# EAGLE design tick-mini-mk-3.0 (EAGLE 6.5.0)
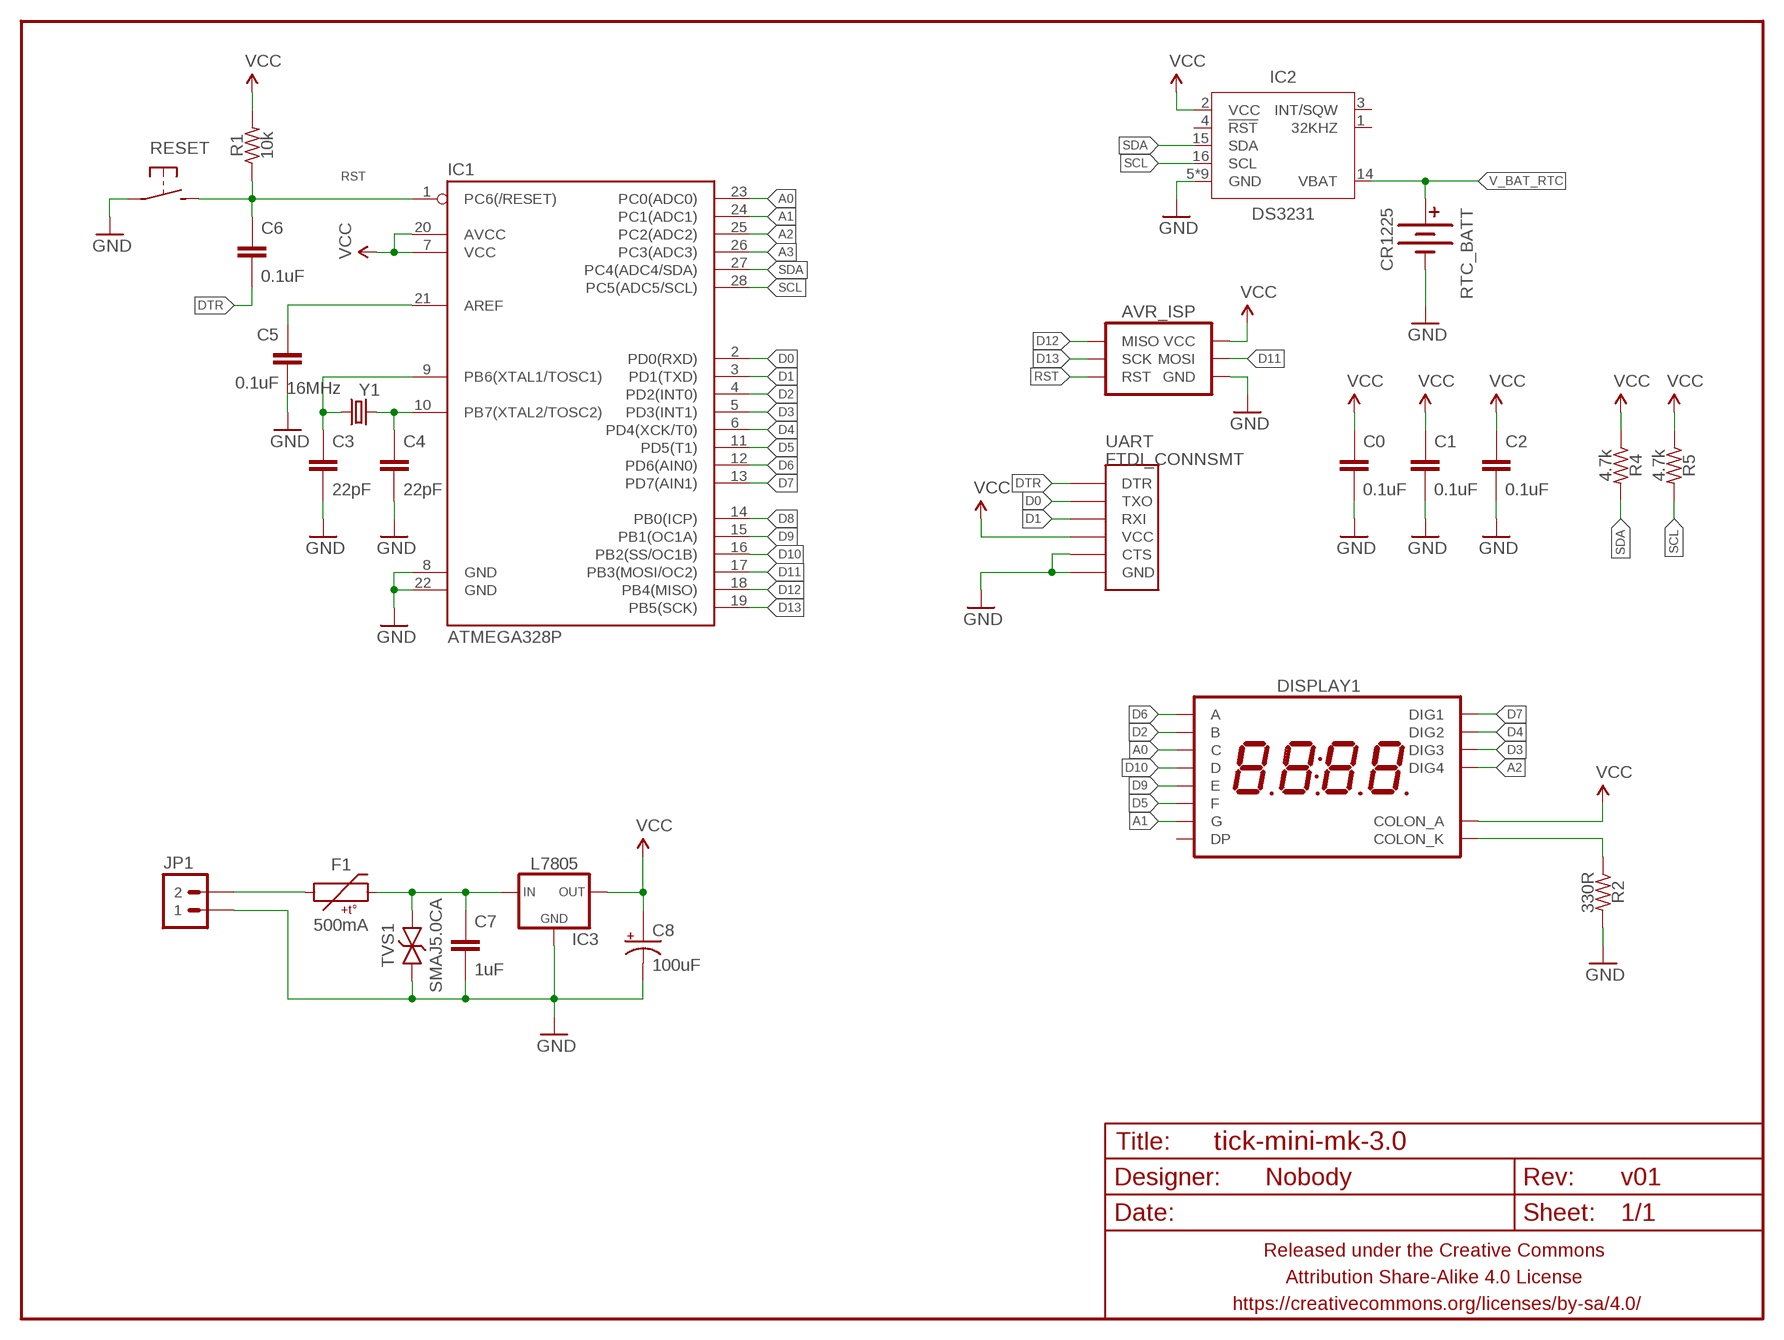
[diagram p0: schematic, sheet 1]

## Parts
AVR_ISP  AVR_SPI_PRG_6PTH  [2X3]
C0  0.1uF  CAPACITOR-CERAMICC0603  [C0603]
C1  0.1uF  CAPACITOR-CERAMICC0603  [C0603]
C2  0.1uF  CAPACITOR-CERAMICC0603  [C0603]
C3  22pF  CAPACITOR-CERAMICC0603  [C0603]
C4  22pF  CAPACITOR-CERAMICC0603  [C0603]
C5  0.1uF  CAPACITOR-CERAMICC0603  [C0603]
C6  0.1uF  CAPACITOR-CERAMICC0603  [C0603]
C7  1uF  CAPACITOR-CERAMICC0805  [C0805]
C8  100uF  CAPACITOR-POLARIZEDE2.5-5  [E2,5-5]
DISPLAY1  7SEG_4DIGIT_COLON14.2MM-CC-NS  [7SEG_4DIG_NS]
F1  500mA  PTCSMD  [PTC-1206]
FRAME1  FRAME-LETTERNO_PACKAGE  [DUMMY]
IC1  ATMEGA328P  ATMEGA328P_PDIP  [DIL28-3]
IC2  DS3231  [SO16W]
IC3  L7805  V_REG_78XX  [SO08]
JP1  M02PTH-CENTERED-R+  [1X02-CENTER-R+]
R1  10k  RESISTORR0603  [R0603]
R2  330R  RESISTORPTH-AXIAL-7.62MM  [RESISTOR-AXIAL-PTH-7.62MM]
R4  4.7k  RESISTORR0603  [R0603]
R5  4.7k  RESISTORR0603  [R0603]
RESET  SPST-NO-TACT3MM-PTH-SMALL-PADS  [DTS-3-SMALL-PADS]
RTC_BATT  CR1225  BATTERY12MM  [BATTCON_12MM]
TVS1  SMAJ5.0CA  TVSSMA  [SMA-DIODE-TVS-BIDIR]
UART  FTDI_CONNSMT  [FTDI_CONN_SMT]
Y1  16MHz  CRYSTALHC49UV  [HC49U-V]

## Nets
A0: DISPLAY1.P$4(C) IC1.23(PC0(ADC0))
A1: DISPLAY1.P$5(G) IC1.24(PC1(ADC1))
A2: DISPLAY1.P$6(DIG4) IC1.25(PC2(ADC2))
A3: IC1.26(PC3(ADC3))
D0: IC1.2(PD0(RXD)) UART.TXO
D1: IC1.3(PD1(TXD)) UART.RXI
D2: DISPLAY1.P$9(B) IC1.4(PD2(INT0))
D3: DISPLAY1.P$10(DIG3) IC1.5(PD3(INT1))
D4: DISPLAY1.P$11(DIG2) IC1.6(PD4(XCK/T0))
D5: DISPLAY1.P$12(F) IC1.11(PD5(T1))
D6: DISPLAY1.P$13(A) IC1.12(PD6(AIN0))
D7: DISPLAY1.P$14(DIG1) IC1.13(PD7(AIN1))
D8: IC1.14(PB0(ICP))
D9: DISPLAY1.P$1(E) IC1.15(PB1(OC1A))
D10: DISPLAY1.P$2(D) IC1.16(PB2(SS/OC1B))
D11: AVR_ISP.4(MOSI) IC1.17(PB3(MOSI/OC2))
D12: AVR_ISP.1(MISO) IC1.18(PB4(MISO))
D13: AVR_ISP.3(SCK) IC1.19(PB5(SCK))
DTR: C6.2 UART.DTR
GND: AVR_ISP.6(GND) C0.2 C1.2 C2.2 C3.2 C4.2 C5.2 C7.2 C8.- IC1.8(GND) IC1.22(GND) IC2.5(GND) IC2.6(GND) IC2.7(GND) IC2.8(GND) IC2.9(GND) IC2.10(GND) IC2.11(GND) IC2.12(GND) IC2.13(GND) IC3.2(GND) IC3.3(GND) IC3.4(GND) IC3.5(GND) IC3.6(GND) IC3.7(GND) JP1.1 R2.P$2 RESET.1 RTC_BATT.GND(-) TVS1.1 UART.CTS UART.GND
N$1: C4.1 IC1.10(PB7(XTAL2/TOSC2)) Y1.1
N$2: C3.1 IC1.9(PB6(XTAL1/TOSC1)) Y1.2
N$3: C5.1 IC1.21(AREF)
N$4: DISPLAY1.P$7(COLON_K) R2.P$1
N$5: F1.1 JP1.2
N$8: C7.1 F1.2 IC3.8(IN) TVS1.2
RST: AVR_ISP.5(RST) C6.1 IC1.1(PC6(/RESET)) R1.1 RESET.2
SCL: IC1.28(PC5(ADC5/SCL)) IC2.16(SCL) R5.2
SDA: IC1.27(PC4(ADC4/SDA)) IC2.15(SDA) R4.2
V_BAT_RTC: IC2.14(VBAT) RTC_BATT.PWR@1(+)
VCC: AVR_ISP.2(VCC) C0.1 C1.1 C2.1 C8.+ DISPLAY1.P$8(COLON_A) IC1.7(VCC) IC1.20(AVCC) IC2.2(VCC) IC3.1(OUT) R1.2 R4.1 R5.1 UART.VCC
Unconnected: DISPLAY1.P$3(DP) IC2.1(32KHZ) IC2.3(INT/SQW) IC2.4(!RST)

## Library data of the parts
AVR_ISP = A_butts:AVR_SPI_PRG_6: AVR ISP 6 Pin This is the reduced ISP connector for AVR programming. Common on Arduino. This footprint will take up less PCB space and can be used with a 10-pin to 6-pin adapter such as SKU: BOB-08508 **Special note about "TEST_POINT" package. The stop mask is on the top side, so if you want your programming test points to be on the bottom of your board, make sure to place this package on the bottom side of the board. This also ensure that the orientation to program from the bottom side will be correct.
C0 C1-C7 = A_butts:CAPACITOR-CERAMIC: CAPACITOR, European symbol
C8 = A_butts:CAPACITOR-POLARIZED: POLARIZED CAPACITOR, American symbol
DISPLAY1 = A_butts:7SEG_4DIGIT_COLON
F1 = A_butts:PTC: Resettable Fuse PTC Resettable Fuse. Spark Fun Electronics SKU : COM-08357; PROD_ID: RES-11150
FRAME1 = A_butts:FRAME-LETTER: Schematic Frame Standard 8.5x11 US Letter frame; DESIGNER: Nobody; VERSION: v01
IC1 = A_butts:ATMEGA328P_PDIP: uC used in the Arduino 32kb flash, 1k EEPROM, 2k SRAM This is the through-hole version of this chip.
IC2 = A_butts:DS3231
IC3 = A_butts:V_REG_78XX: Voltage Regulator Standard 7805 5V regulator. IGO (Input Ground Output). Spark Fun Electronics SKU : COM-00107
JP1 = A_butts:M02: Standard 2-pin 0.1" header. Use with - straight break away headers ( PRT-00116) - right angle break away headers (PRT-00553) - swiss pins (PRT-00743) - machine pins (PRT-00117) - female headers (PRT-00115) Molex polarized connector foot print use with: PRT-08233 with associated crimp pins and housings. 2.54_SCREWTERM for use with PRT-10571. 3.5mm Screw Terminal footprints for PRT-08084 5mm Screw Terminal footprints for use with PRT-08433
R1 R2 R4 R5 = A_butts:RESISTOR: RESISTOR, American symbol
RESET = A_butts:SPST-NO-TACT
RTC_BATT = A_butts:BATTERY: Battery Holders Various common sizes : AA, AAA, 20mm coin cell and 12mm coin cell. 20MM_4LEGS, BATT-10373
TVS1 = A_butts:TVS: Transient voltage suppressor- prevents ESD on inputs. Ignore package description- MBRA140 is NOT this type of part!!!
UART = A_butts:FTDI_CONN: Connector which mates to FTDI basic or FTDI cable.
Y1 = A_butts:CRYSTAL: Various standard crystals. Proven footprints. Spark Fun Electronics SKU : COM-00534

## Board
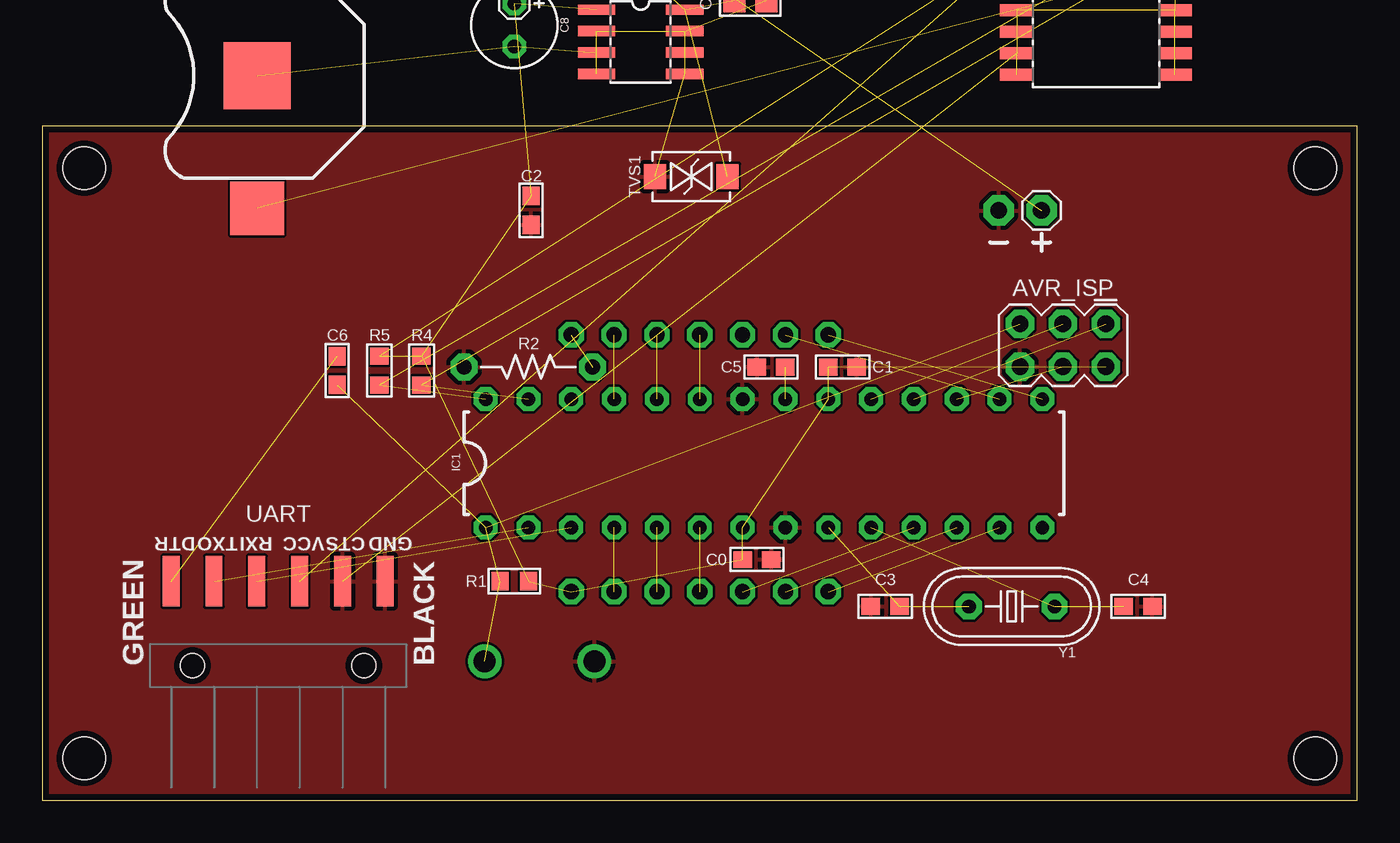
[diagram p1: board, top side]
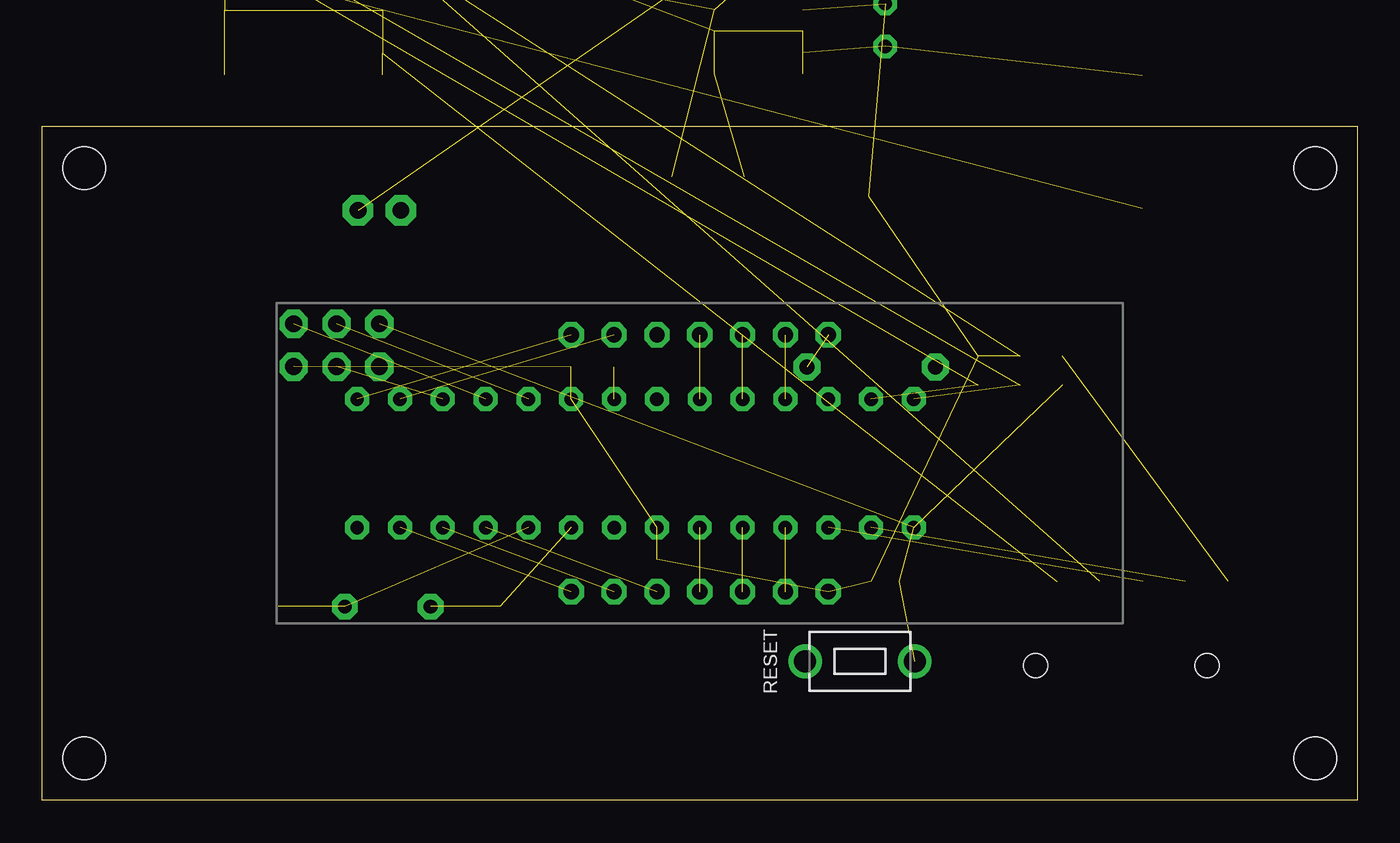
[diagram p2: board, bottom side, seen from below]

Size 78 x 40 mm. Coordinates in mm from the lower left corner, seen from the top.
Outline: 78,0 78,40 0,40 0,0 78,0
Copper layers (1*16): Top 0.0356mm / dielectric 1.5011mm / Bottom 0.0356mm
Design rules "LaenPCBOrder_2": minimum track width 6mil, minimum drill 13mil, track to track 6mil, track to pad 6mil, pad to pad 6mil, via to via 6mil, smd to smd 6mil, copper to edge 15mil, drill to drill 6mil, minimum pad ring 7mil, minimum via ring 7mil, stop-mask expansion 3mil, vias tented up to drill 20mil, thermal gap 10mil
Holes 2.5 mm at 2.5,37.5 2.5,2.5 75.5,2.5 75.5,37.5

### Footprints (pad centres in the part's own frame; a part is rotated, then mirrored left to right if it is on the bottom)
2X3 = drill 1 pad 1.676 octagon: 1 -2.54,-1.27; 2 -2.54,1.27; 3 0,-1.27; 4 0,1.27; 5 2.54,-1.27; 6 2.54,1.27
C0603 = smd 1.1 x 1: 1 -0.85,0; 2 0.85,0
C0805 = smd 1.3 x 1.5: 1 -0.95,0; 2 0.95,0
E2,5-5 = drill 0.8 pad 1.4 octagon: + -1.27,0; - 1.27,0
7SEG_4DIG_NS = drill 0.9 pad 1.5 octagon: P$1 -7.62,7.62; P$2 -5.08,7.62; P$3 -2.54,7.62; P$4 0,7.62; P$5 2.54,7.62; P$6 5.08,7.62; P$7 7.62,7.62; P$8 7.62,-7.62; P$9 5.08,-7.62; P$10 2.54,-7.62; P$11 0,-7.62; P$12 -2.54,-7.62; P$13 -5.08,-7.62; P$14 -7.62,-7.62
PTC-1206 = smd 1 x 1.8: 1 -1.4,0; 2 1.4,0
DIL28-3 = drill 0.8 pad 1.422 octagon: 1 -16.51,-3.81; 2 -13.97,-3.81; 3 -11.43,-3.81; 4 -8.89,-3.81; 5 -6.35,-3.81; 6 -3.81,-3.81; 7 -1.27,-3.81; 8 1.27,-3.81; 9 3.81,-3.81; 10 6.35,-3.81; 11 8.89,-3.81; 12 11.43,-3.81; 13 13.97,-3.81; 14 16.51,-3.81; 15 16.51,3.81; 16 13.97,3.81; 17 11.43,3.81; 18 8.89,3.81; 19 6.35,3.81; 20 3.81,3.81; 21 1.27,3.81; 22 -1.27,3.81; 23 -3.81,3.81; 24 -6.35,3.81; 25 -8.89,3.81; 26 -11.43,3.81; 27 -13.97,3.81; 28 -16.51,3.81
SO16W = smd 0.7 x 2: 1 -4.445,-4.685; 2 -3.175,-4.685; 3 -1.905,-4.685; 4 -0.635,-4.685; 5 0.635,-4.685; 6 1.905,-4.685; 7 3.175,-4.685; 8 4.445,-4.685; 9 4.445,4.685; 10 3.175,4.685; 11 1.905,4.685; 12 0.635,4.685; 13 -0.635,4.685; 14 -1.905,4.685; 15 -3.175,4.685; 16 -4.445,4.685
SO08 = smd 0.61 x 2.21: 1 -1.905,-2.616; 2 -0.635,-2.616; 3 0.635,-2.616; 4 1.905,-2.616; 5 1.905,2.616; 6 0.635,2.616; 7 -0.635,2.616; 8 -1.905,2.616
1X02-CENTER-R+ = drill 1 pad 1.8 octagon: 1 -1.27,0; 2 1.27,0
R0603 = smd 1 x 1.1: 1 -0.85,0; 2 0.85,0
RESISTOR-AXIAL-PTH-7.62MM = drill 0.9 pad 1.6 octagon: P$1 -3.81,0; P$2 3.81,0
DTS-3-SMALL-PADS = drill 1.3 pad 2: 1 -3.25,0; 2 3.25,0
BATTCON_12MM = smd 3.962 x 3.962: GND 0,0 | smd 3.175 x 3.175: PWR@1 -7.874,0; PWR@2 7.874,0
SMA-DIODE-TVS-BIDIR = smd 1.3 x 1.5: 1 -2.15,0; 2 2.15,0
FTDI_CONN_SMT = smd 1 x 3: CTS 3.81,0; DTR -6.35,0; GND 6.35,0; RXI -1.27,0; TXO -3.81,0; VCC 1.27,0 | hole 1.4: -5.08,-5; 5.08,-5
HC49U-V = drill 0.813 pad 1.524 octagon: 1 -2.54,0; 2 2.54,0

### Placement (x,y rotation side)
AVR_ISP  60.54,27 180 top
C0  42.39,14.29 0 top
C1  47.47,25.71 0 top
C2  29,35 270 top
C3  50,11.5 180 top
C4  65,11.5 0 top
C5  43.23,25.71 180 top
C6  17.5,25.5 90 top
C7  42,47.5 0 top  (outside the outline)
C8  28,46 270 top  (outside the outline)
DISPLAY1  39,20 0 bottom
F1  35.5,50.5 180 top  (outside the outline)
FRAME1  0,0 0 top
IC1  42.81,20 0 top
IC2  62.5,47.5 270 top  (outside the outline)
IC3  35.5,45 270 top  (outside the outline)
JP1  58,35 0 top
R1  28,13 0 top
R2  28.84,25.71 180 top
R4  22.5,25.5 270 top
R5  20,25.5 270 top
RESET  29.5,8.25 0 bottom
RTC_BATT  12.75,43 90 top
TVS1  38.5,37 0 top
UART  14,13 0 top
Y1  57.5,11.5 180 top

### Tracks (layer width: path | path; a pad name or v marks a point on that pad's centre or on a via)
A0  (1 unrouted)
A1  (1 unrouted)
A2  (1 unrouted)
D0  (1 unrouted)
D1  (1 unrouted)
D2  (1 unrouted)
D3  (1 unrouted)
D4  (1 unrouted)
D5  (1 unrouted)
D6  (1 unrouted)
D7  (1 unrouted)
D9  (1 unrouted)
D10  (1 unrouted)
D11  (1 unrouted)
D12  (1 unrouted)
D13  (1 unrouted)
DTR  (1 unrouted)
GND  (18 unrouted)
  pour Top: -0.1,40.1 78.1,40.1 78.1,-0.1 -0.1,-0.1
N$1  (2 unrouted)
N$2  (2 unrouted)
N$3  (1 unrouted)
N$4  (1 unrouted)
N$5  (1 unrouted)
N$8  (3 unrouted)
RST  (4 unrouted)
SCL  (2 unrouted)
SDA  (2 unrouted)
V_BAT_RTC  (1 unrouted)
VCC  (13 unrouted)